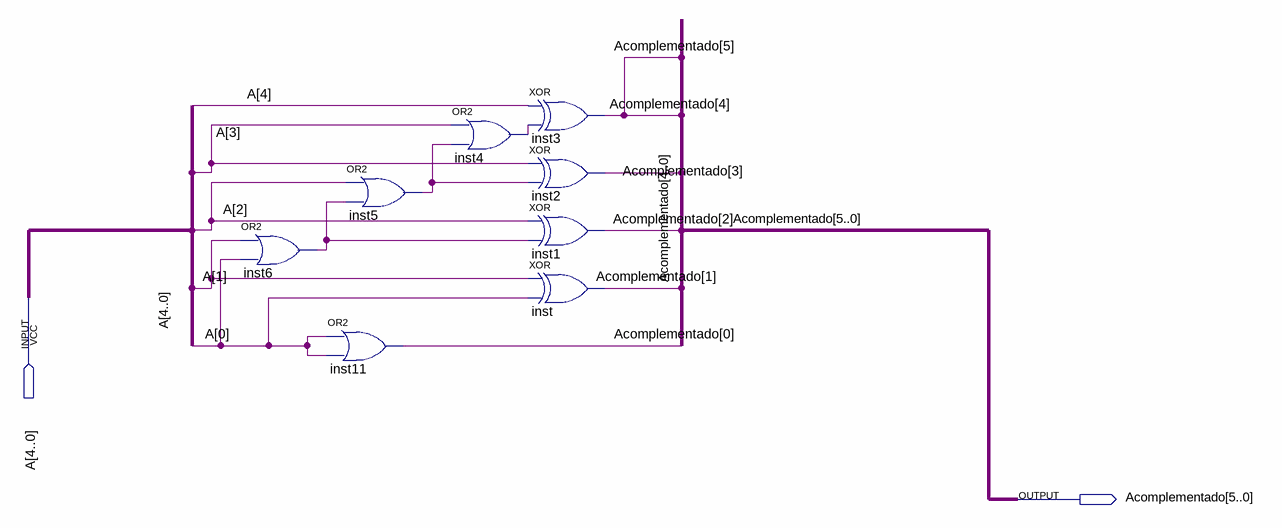
[diagram p0: schematic sheet]
// Quartus schematic Renan_complementador_de_2.bdf as structural Verilog: 8 symbols, 2 pins
module Renan_complementador_de_2 (
  input  [4:0] A,
  output [5:0] Acomplementado
);

  wire inst4_out, inst5_out, inst6_out;

  or inst6 (inst6_out, A[1], A[0]);
  or inst11 (Acomplementado[0], A[0], A[0]);
  or inst5 (inst5_out, A[2], inst6_out);
  or inst4 (inst4_out, A[3], inst5_out);
  xor inst3 (Acomplementado[5], A[4], inst4_out);
  xor inst2 (Acomplementado[3], A[3], inst5_out);
  xor inst1 (Acomplementado[2], A[2], inst6_out);
  xor inst (Acomplementado[1], A[1], A[0]);

  assign Acomplementado[4] = Acomplementado[5];
endmodule
